# Altium schematic sheet [3] Sensor.SchDoc
size A4; Organization: UNMEI ELECTRICAL; Address1: 16B/12 Nguyen Du Street; Address2: Da Lat City, LD Province; SheetNumber: 3; SheetTotal: 7
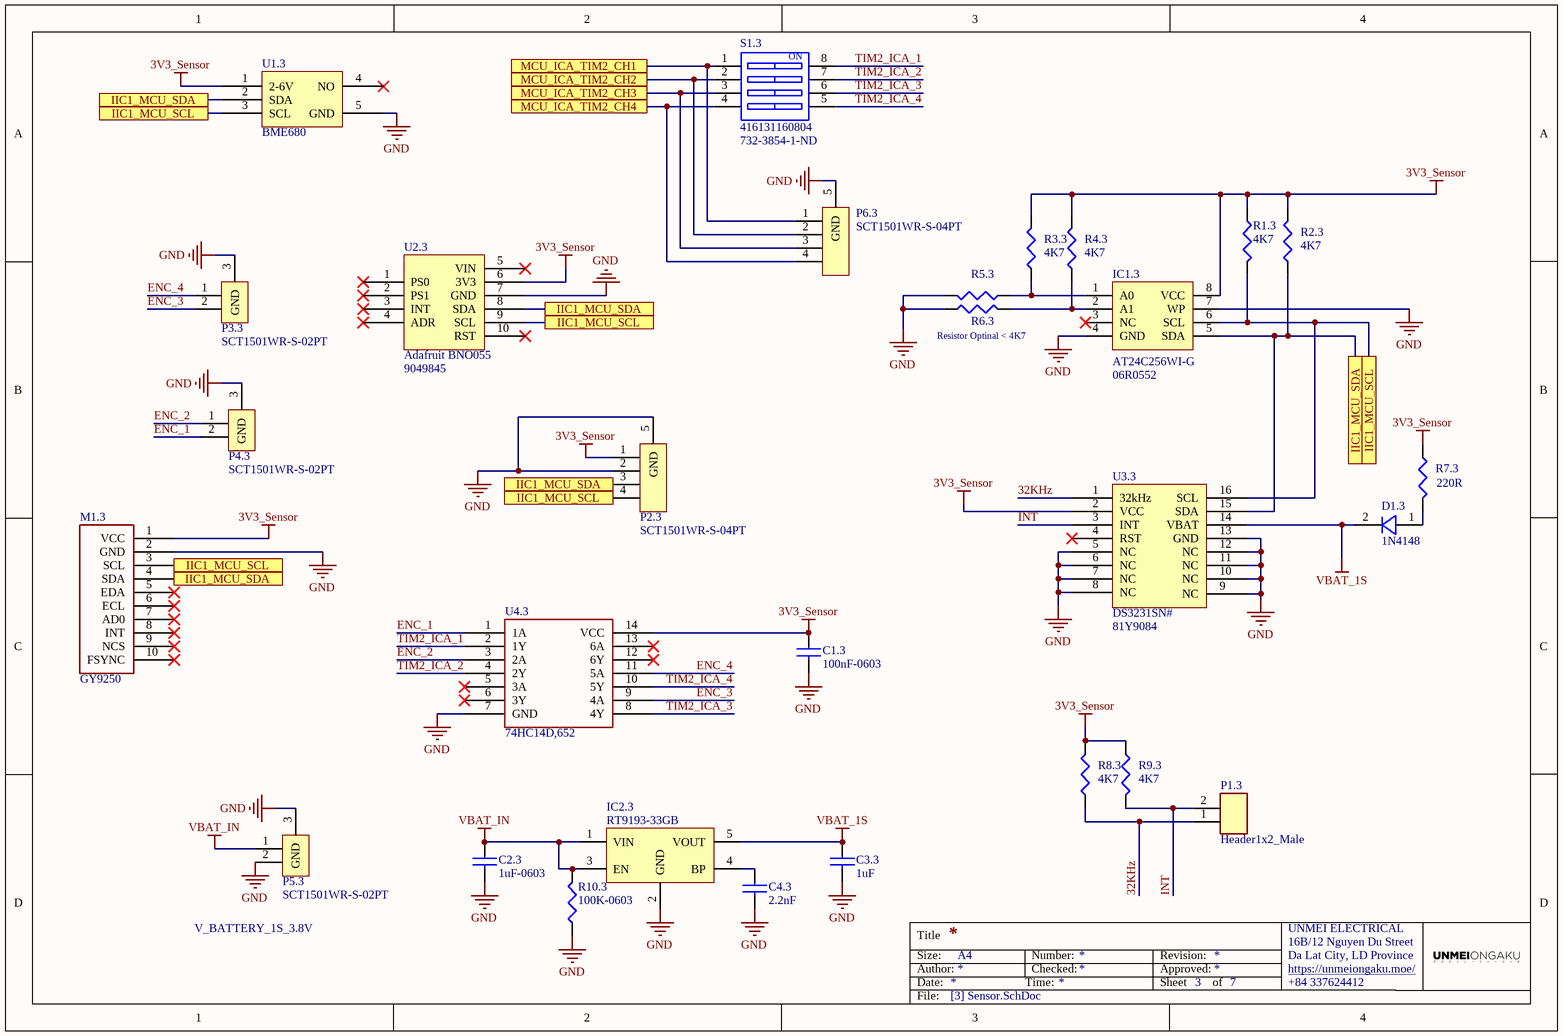
[diagram p0: [3] Sensor.SchDoc]

## Parts
C1.3  100nF-0603  [CAP0603]
C2.3  1uF-0603  [CAP0603]
C3.3  1uF  [CAP0603]
C4.3  2.2nF  [CAP0603]
D1.3  1N4148  [SOD-80]
IC1.3  AT24C256WI-G  Supplier Part Number 1: 06R0552  [SOP8]
IC2.3  RT9193-33GB  [SOT23-5]
M1.3  GY9250  [GY9250]
P1.3  Header1x2_Male  [HDR1x2_2.54_MALE]
P2.3  SCT1501WR-S-04PT  [Connector ZH1.5 4P SMD]
P3.3  SCT1501WR-S-02PT  [Connector ZH1.5 2P SMD]
P4.3  SCT1501WR-S-02PT  [Connector ZH1.5 2P SMD]
P5.3  SCT1501WR-S-02PT  [Connector ZH1.5 2P SMD]
P6.3  SCT1501WR-S-04PT  [Connector ZH1.5 4P SMD]
R1.3  4K7  [RES0603 - 3D]
R2.3  4K7  [RES0603 - 3D]
R3.3  4K7  [RES0603 - 3D]
R4.3  4K7  [RES0603 - 3D]
R5.3  70R  [RES0805]  (value not drawn)
R6.3  70R  [RES0805]  (value not drawn)
R7.3  220R  [RES0603 - 3D]
R8.3  4K7  [RES0603 - 3D]
R9.3  4K7  [RES0603 - 3D]
R10.3  100K-0603  [RES0603 - 3D]
S1.3  416131160804  Supplier Part Number 1: 732-3854-1-ND  [DIP Switches SMD 1.27mm 4P]
U1.3  BME680  [BME680]
U2.3  Adafruit BNO055  Supplier Part Number 1: 9049845  [Adafruit BNO055]
U3.3  DS3231SN#  Supplier Part Number 1: 81Y9084  [SOIC-16W]
U4.3  74HC14D,652  [SOT108-1_NEX]

## Ports
IIC1_MCU_SCL, IIC1_MCU_SDA, MCU_ICA_TIM2_CH1, MCU_ICA_TIM2_CH2, MCU_ICA_TIM2_CH3, MCU_ICA_TIM2_CH4

## Nets
3V3_Sensor: C1.3.1 IC1.3.8(VCC) M1.3.1(VCC) P2.3.1 R1.3.1 R2.3.2 R3.3.2 R4.3.2 R7.3.1 R8.3.2 R9.3.1 U1.3.1(2-6V) U2.3.6(3V3) U3.3.2(VCC) U4.3.14(VCC)
GND: C1.3.2 C2.3.2 C3.3.2 C4.3.2 IC1.3.4(GND) IC1.3.7(WP) IC2.3.2(GND) M1.3.2(GND) P2.3.2 P2.3.5(GND) P3.3.3(GND) P4.3.3(GND) P5.3.2 P5.3.3(GND) P6.3.5(GND) R5.3.2 R6.3.1 R10.3.1 U1.3.5(GND) U2.3.7(GND) U3.3.5(NC) U3.3.6(NC) U3.3.7(NC) U3.3.8(NC) U3.3.9(NC) U3.3.10(NC) U3.3.11(NC) U3.3.12(NC) U3.3.13(GND) U4.3.7(GND)
VBAT_1S: C3.3.1 D1.3.2(Cathode) IC2.3.5(VOUT) U3.3.14(VBAT)
VBAT_IN: C2.3.1 IC2.3.1(VIN) IC2.3.3(EN) P5.3.1 R10.3.2
32KHz: P1.3.1 R8.3.1 U3.3.1(32kHz)
ENC_1: P4.3.2 U4.3.1(1A)
ENC_2: P4.3.1 U4.3.3(2A)
ENC_3: P3.3.2 U4.3.9(4A)
ENC_4: P3.3.1 U4.3.11(5A)
IIC1_MCU_SCL: IC1.3.6(SCL) M1.3.3(SCL) P2.3.4 R1.3.2 U1.3.3(SCL) U2.3.9(SCL) U3.3.16(SCL) ; port IIC1_MCU_SCL
IIC1_MCU_SDA: IC1.3.5(SDA) M1.3.4(SDA) P2.3.3 R2.3.1 U1.3.2(SDA) U2.3.8(SDA) U3.3.15(SDA) ; port IIC1_MCU_SDA
INT: P1.3.2 R9.3.2 U3.3.3(INT)
MCU_ICA_TIM2_CH1: P6.3.1 S1.3.1 ; port MCU_ICA_TIM2_CH1
MCU_ICA_TIM2_CH2: P6.3.2 S1.3.2 ; port MCU_ICA_TIM2_CH2
MCU_ICA_TIM2_CH3: P6.3.3 S1.3.3 ; port MCU_ICA_TIM2_CH3
MCU_ICA_TIM2_CH4: P6.3.4 S1.3.4 ; port MCU_ICA_TIM2_CH4
TIM2_ICA_1: S1.3.8 U4.3.2(1Y)
TIM2_ICA_2: S1.3.7 U4.3.4(2Y)
TIM2_ICA_3: S1.3.6 U4.3.8(4Y)
TIM2_ICA_4: S1.3.5 U4.3.10(5Y)
NetC4.3_1: C4.3.1 IC2.3.4(BP)
NetD1.3_1: D1.3.1(Anode) R7.3.2
NetIC1.3_1: IC1.3.1(A0) R3.3.1 R5.3.1
NetIC1.3_2: IC1.3.2(A1) R4.3.1 R6.3.2

Not connected (* = marked no-connect by the designer): IC1.3 3(NC)*; M1.3 5(EDA)* 6(ECL)* 7(AD0)* 8(INT)* 9(NCS)* 10(FSYNC)*; U1.3 4(NO)*; U2.3 1(PS0)* 2(PS1)* 3(INT)* 4(ADR)* 5(VIN)* 10(RST)*; U3.3 4(RST)*; U4.3 5(3A)* 6(3Y)* 12(6Y)* 13(6A)*

## Notes on the sheet
- Resistor Optinal < 4K7
- V_BATTERY_1S_3.8V
- Title
- Size:
- Date:
- Author:
- A4
- Time:
- Number:
- Checked:
- Revision:
- Sheet
- Approved:
- of
- https://unmeiongaku.moe/
- +84 337624412
- File:
- (in symbol 416131160804) ON

## Library data of the parts
C1.3 = CC0603KRX7R9BB104: CAP CER 0.1UF 50V X7R 0603; Manufacturer 1: Yageo; Category 1: Capacitors; Capacitance: 0.1µF; Tolerance: ±10%; Value: 100nF; Supplier 1: Digi-Key; Supplier Part Number 1: 311-1344-1-ND; Manufacturer Part Number 1: CC0603KRX7R9BB104; RoHS 1: RoHS Compliant; Description 1: CAP CER 0.1UF 50V X7R 0603; Stock 1: 4411645; Pricing 1: 1=0.1, 10=0.031, 100=0.014, 500=0.00998, 1000=0.00783 (USD); Packaging: Cut Tape (CT); Part Status: Active; Voltage - Rated: 50V; Temperature Coefficient: X7R; Operating Temperature: -55°C ~ 125°C; Features: -; Ratings: -; Applications: General Purpose; Failure Rate: -; Mounting Type: Surface Mount, MLCC; Package / Case: 0603 (1608 Metric); Size / Dimension: 0.063" L x 0.031" W (1.60mm x 0.80mm); Height - Seated (Max): -; Thickness (Max): 0.035" (0.90mm); Lead Spacing: -; Lead Style: -; ComponentLink1URL: http://www.yageo.com/documents/recent/UPY-GPHC_X7R_6.3V-to-50V_18.pdf; ComponentLink1Description: http://www.yageo.com/documents/recent/UPY-GPHC_X7R_6.3V-to-50V_18.pdf
C2.3 C3.3 = CC0603KRX7R7BB105: CAP CER 1UF 16V X7R 0603; Manufacturer 1: Yageo; Category 1: Capacitors; Capacitance: 1µF; Tolerance: ±10%; Supplier 1: Digi-Key; Supplier Part Number 1: 311-1446-1-ND; Manufacturer Part Number 1: CC0603KRX7R7BB105; RoHS 1: RoHS Compliant; Description 1: CAP CER 1UF 16V X7R 0603; Stock 1: 274580; Pricing 1: 1=0.1, 10=0.051, 100=0.0227, 500=0.0162, 1000=0.01274 (USD); Packaging: Cut Tape (CT); Part Status: Active; Voltage - Rated: 16V; Temperature Coefficient: X7R; Operating Temperature: -55°C ~ 125°C; Features: -; Ratings: -; Applications: General Purpose; Failure Rate: -; Mounting Type: Surface Mount, MLCC; Package / Case: 0603 (1608 Metric); Size / Dimension: 0.063" L x 0.031" W (1.60mm x 0.80mm); Height - Seated (Max): -; Thickness (Max): 0.035" (0.90mm); Lead Spacing: -; Lead Style: -; ComponentLink1URL: http://www.yageo.com/documents/recent/UPY-GPHC_X7R_6.3V-to-50V_18.pdf; ComponentLink1Description: http://www.yageo.com/documents/recent/UPY-GPHC_X7R_6.3V-to-50V_18.pdf; Value: 1uF
C4.3 = CC0603KRX7R9BB222: Multilayer Ceramic Capacitors MLCC - SMD/SMT 2200PF 50V 10% 0603; Manufacturer: Yageo; Type: General Purpose and High Capacitance Surface Mount Ceramic Multilayer Capacitor; Voltage Rating DC: 50 VDC; Capacitance - uF: 0.0022 uF; Class: Class 2; Dielectric: X7R; Supplier 1: Mouser; Manufacturer Part Number: CC0603KRX7R9BB222; RoHS: RoHS Compliant; Category: Multilayer Ceramic Capacitors MLCC - SMD/SMT; Stock 1: 167669; Pricing 1: 1=0.100, 10=0.090, 100=0.070, 1000=0.065, 4000=0.010, 8000=0.009 (USD); Capacitance: 2200 pF; Height: 0.8 mm; Length: 1.6 mm; Package / Case: 0603 (1608 metric); Packaging: Cut Tape; Product: General Type MLCCs; Series: CC; Termination Style: SMD/SMT; Tolerance: 10 %; Brand: Yageo; Capacitance - nF: 2.2 nF; Case Code - in: 0603; Case Code - mm: 1608; Maximum Operating Temperature: + 125 C; Minimum Operating Temperature: - 55 C; Product Type: Ceramic Capacitors; Standard Pack Qty: 4000; Subcategory: Capacitors; Termination: Standard; RoHS - Mouser: Y; Minimum Order Quantity: 1; Reeling: True; ComponentLink1URL: https://www.mouser.com/datasheet/2/447/UPY-GPHC_X7R_6.3V-to-50V_18-1154002.pdf; ComponentLink1Description: https://www.mouser.com/datasheet/2/447/UPY-GPHC_X7R_6.3V-to-50V_18-1154002.pdf; Supplier Part Number 1: 603-C0603KRX7R9BB222; Width: 0.8 mm; Value: 2.2nF
D1.3 = 1N4148: Rectifier Diode Small Signal Switching 100V 0.2A 4ns Automotive 2-Pin DO-35 Ammo; Manufacturer: NTE Electronics; Forward Voltage: 1V; Element Configuration: Single; Max Repetitive Reverse Voltage (Vrrm): 75V; Forward Current: 300mA; Current Rating: 200mA; Polarity: Standard; Capacitance: 4pF; Max Forward Surge Current (Ifsm): 1A; Power Dissipation: 500mW; Supplier 1: Allied Electronics; Manufacturer Part Number: 1N4148; RoHS: Yes; Category: Rectifier Diodes; Stock 1: 5690; Pricing 1: 1=0.08800 (USD); Mount: Through Hole; Case/Package: DO-35; Number of Pins: 2; Min Operating Temperature: -65°C; Max Operating Temperature: 175°C; Packaging: Tape and Reel; Reverse Recovery Time: 4ns; Voltage Rating (DC): 100V; Output Current: 200mA; Diameter: 2mm; Length: 4mm; RoHS Compliant: Yes; Lead Free: Lead Free; ComponentLink1URL: https://datasheet.ciiva.com/7624/1n4148-4448-7624426.pdf?src-supplier=Element14; ComponentLink1Description: https://datasheet.ciiva.com/7624/1n4148-4448-7624426.pdf?src-supplier=Element14; Supplier Part Number 1: 70214727
IC1.3 = AT24C256WI-G: CAT24C256 Series 256 Kb (32K X 8)  1.8 V - 5.5 V I2C CMOS Serial EEPROM - SOIC-8; Manufacturer: ON Semiconductor; Manufacturer Part Number: CAT24C256WI-G; Frequency: 400kHz; Access Time: 500ns; Memory Size: 256Kb; Interface: I2C,Serial; Max Supply Voltage: 5.5V; Min Supply Voltage: 1.8V; Memory Type: Non-Volatile,EEPROM; Max Frequency: 100kHz; Nominal Supply Current: 3mA; Access Time-Max: 900ns; Organization: 32KX8; Write Protection: YES; Operating Supply Voltage: 5V; Write Cycle Time-Max (tWC): 5ms; Supplier 1: Newark; RoHS: Yes; Category: EEPROM; Mount: Surface Mount; Case/Package: SOIC; Number of Pins: 8; Contact Plating: Gold; Min Operating Temperature: -40°C; Max Operating Temperature: 85°C; Packaging: Rail/Tube; Package Quantity: 100; Series: -; Density: 256Kb; Supply Current: 3mA; Supply Voltage-Nom: 5.5V; Radiation Hardening: No; Lead Free: Lead Free; RoHS Compliant: Yes; Reach SVHC Compliant: Yes; ComponentLink1URL: https://datasheet.ciiva.com/1166/cat24c256-d-1166416.pdf?src-supplier=Newark; ComponentLink1Description: https://datasheet.ciiva.com/1166/cat24c256-d-1166416.pdf?src-supplier=Newark; ComponentLink2URL: https://datasheet.ciiva.com/15123/getdatasheetpartid-257691-15123320.pdf?src-supplier=Verical; ComponentLink2Description: https://datasheet.ciiva.com/15123/getdatasheetpartid-257691-15123320.pdf?src-supplier=Verical; ComponentLink3URL: https://datasheet.ciiva.com/5700/cat24c256-d-5700793.pdf?src-supplier=Farnell; ComponentLink3Description: https://datasheet.ciiva.com/5700/cat24c256-d-5700793.pdf?src-supplier=Farnell; ComponentLink4URL: https://datasheet.ciiva.com/8072/cat24c256-d-8072141.pdf?src-supplier=Element14; ComponentLink4Description: https://datasheet.ciiva.com/8072/cat24c256-d-8072141.pdf?src-supplier=Element14; ComponentLink5URL: https://datasheet.ciiva.com/4859/cat24c256-d-105771-4859399.pdf?src-supplier=Mouser; ComponentLink5Description: https://datasheet.ciiva.com/4859/cat24c256-d-105771-4859399.pdf?src-supplier=Mouser; ComponentLink6URL: https://datasheet.ciiva.com/3185/cat24c256-d-3185116.pdf?src-supplier=Avnet; ComponentLink6Description: https://datasheet.ciiva.com/3185/cat24c256-d-3185116.pdf?src-supplier=Avnet; ComponentLink7URL: https://datasheet.ciiva.com/16456/cat24c256-d-16456381.pdf?src-supplier=Future+Electronics; ComponentLink7Description: https://datasheet.ciiva.com/16456/cat24c256-d-16456381.pdf?src-supplier=Future+Electronics; ComponentLink8URL: https://datasheet.ciiva.com/1912/cat24c256-d-1912247.pdf?src-supplier=Digi-Key; ComponentLink8Description: https://datasheet.ciiva.com/1912/cat24c256-d-1912247.pdf?src-supplier=Digi-Key
IC2.3 = RT9193-33GB: IC REG LDO 3.3V 0.3A SOT23-5
P1.3 = HDR1x2_2.54_MALE: Header1x2_2.54_MALE
R1.3 R2.3 R3.3 R4.3 R8.3 R9.3 = RC0603JR-074K7L: RES SMD 4.7K OHM 5% 1/10W 0603; Manufacturer: Yageo; Power (Watts): 0.1W, 1/10W; Temperature Coefficient: ±100ppm/°C; Supplier 1: Digi-Key; Manufacturer Part Number: RC0603JR-074K7L; RoHS: RoHS Compliant; Category: Resistors; Stock 1: 4925196; Pricing 1: 1=0.1, 10=0.011, 100=0.0046, 1000=0.00207, 2500=0.0018 (USD); Packaging: Cut Tape (CT); Part Status: Active; Tolerance: ±5%; Composition: Thick Film; Features: Moisture Resistant; Operating Temperature: -55°C ~ 155°C; Package / Case: 0603 (1608 Metric); Supplier Device Package: 0603; Size / Dimension: 0.063" L x 0.032" W (1.60mm x 0.80mm); Height - Seated (Max): 0.022" (0.55mm); Failure Rate: -; ComponentLink1URL: http://www.yageo.com/documents/recent/PYu-RC_Group_51_RoHS_L_7.pdf; ComponentLink1Description: http://www.yageo.com/documents/recent/PYu-RC_Group_51_RoHS_L_7.pdf; Supplier Part Number 1: 311-4.7KGRCT-ND; Value: 4K7
R5.3 R6.3 = RC0805JR-070RP: Res Jumper Thick Film 0805 0 Ohm 5% 1/8W Molded SMD Paper T/R; Manufacturer: Yageo; Resistance: 0mR; Max Power Dissipation: 125mW; Supplier 1: Arrow Electronics; Manufacturer Part Number: RC0805JR-070RP; RoHS: Yes; Category: Chip SMD Resistors; Stock 1: 10000; Pricing 1: 5000=0.00800, 10000=0.00690, 25000=0.00590, 50000=0.00480 (USD); Case/Package: 0805; Case Code (Metric): 2012; Case Code (Imperial): 0805; Min Operating Temperature: -55°C; Max Operating Temperature: 155°C; Resistor Type: Thick Film; Packaging: Tape and Reel; Number of Terminations: 2; Features: Moisture Resistant; Length: 0.079inch; Width: 0.049inch; Height: 0.024inch; Supplier Part Number 1: RC0805JR-070RP
R7.3 = RC0603JR-07220RL: RES SMD 220 OHM 5% 1/10W 0603; Manufacturer 1: Yageo; Category 1: Resistors; Resistance (Ohms): 220; Power (Watts): 0.1W, 1/10W; Temperature Coefficient: ±100ppm/°C; Supplier 1: Digi-Key; Supplier Part Number 1: 311-220GRCT-ND; Manufacturer Part Number 1: RC0603JR-07220RL; RoHS 1: RoHS Compliant; Description 1: RES SMD 220 OHM 5% 1/10W 0603; Stock 1: 1346821; Pricing 1: 1=0.1, 10=0.011, 100=0.0044, 1000=0.00198, 2500=0.00172 (USD); Packaging: Cut Tape (CT); Part Status: Active; Tolerance: ±5%; Composition: Thick Film; Features: Moisture Resistant; Operating Temperature: -55°C ~ 155°C; Package / Case: 0603 (1608 Metric); Supplier Device Package: 0603; Size / Dimension: 0.063" L x 0.031" W (1.60mm x 0.80mm); Height - Seated (Max): 0.022" (0.55mm); Failure Rate: -; ComponentLink1URL: http://www.yageo.com/documents/recent/PYu-RC_Group_51_RoHS_L_7.pdf; ComponentLink1Description: http://www.yageo.com/documents/recent/PYu-RC_Group_51_RoHS_L_7.pdf; Value: 220R
R10.3 = RC0603JR-07100KL: RES SMD 100K OHM 5% 1/10W 0603; Manufacturer 1: Yageo; Category 1: Resistors; Power (Watts): 0.1W, 1/10W; Temperature Coefficient: ±100ppm/°C; Supplier 1: Digi-Key; Supplier Part Number 1: 311-100KGRCT-ND; Manufacturer Part Number 1: RC0603JR-07100KL; RoHS 1: RoHS Compliant; Description 1: RES SMD 100K OHM 5% 1/10W 0603; Stock 1: 3591837; Pricing 1: 1=0.1, 10=0.011, 100=0.0044, 1000=0.00198, 2500=0.00172 (USD); Packaging: Cut Tape (CT); Part Status: Active; Resistance (Ohms): 100k; Tolerance: ±5%; Composition: Thick Film; Features: Moisture Resistant; Operating Temperature: -55°C ~ 155°C; Package / Case: 0603 (1608 Metric); Supplier Device Package: 0603; Size / Dimension: 0.063" L x 0.031" W (1.60mm x 0.80mm); Height - Seated (Max): 0.022" (0.55mm); Failure Rate: -; ComponentLink1URL: http://www.yageo.com/documents/recent/PYu-RC_Group_51_RoHS_L_7.pdf; ComponentLink1Description: http://www.yageo.com/documents/recent/PYu-RC_Group_51_RoHS_L_7.pdf; Value: 100K
S1.3 = 416131160804: DIP Switch Dimensions L x W x H: 5.6 x 2 mm Series: WS-DISV L: 6.12 mm Poles: 4; Manufacturer: Wurth Electronics; Body Material: Polyphenylene,Polyphthalamide; Mechanical Life: 2000Cycles; Contact Resistance: 50mR; Contact Current Rating: 25mA; Number of Positions: 4; Voltage Rating (DC): 24V; Electrical Life: 1000Cycles; Throw Configuration: SPST; Insulation Resistance: 100MR; Actuator Type: Slide (Standard); Pitch: 0.05inch; Washable: Yes; Supplier 1: Digi-Key; Manufacturer Part Number: 416131160804; RoHS: Yes; Category: DIP Switches; Stock 1: 13030; Pricing 1: 1=5.25000, 10=5.08200, 50=4.81400, 100=4.27900, 500=4.01200 (USD); Mount: Surface Mount; Contact Material: Copper Alloy,Gold; Contact Plating: Gold; Min Operating Temperature: -40°C; Max Operating Temperature: 85°C; Package Quantity: 1; Packaging: Cut Tape; Current Rating: 25mA; Termination: Gull Wing; Number of Circuits: 4; Max Voltage Rating (DC): 24V; Series: WS-DISV; Length: 0.241inch; Width: 5.6mm; Height: 2mm; Reach SVHC Compliant: Yes; Lead Free: Lead Free; RoHS Compliant: Yes; ComponentLink1URL: https://datasheet.ciiva.com/30467/0900766b812902d9-30467107.pdf?src-supplier=RSComponents; ComponentLink1Description: https://datasheet.ciiva.com/30467/0900766b812902d9-30467107.pdf?src-supplier=RSComponents; ComponentLink2URL: https://datasheet.ciiva.com/1528/4161311608xx-1528928.pdf?src-supplier=Element14; ComponentLink2Description: https://datasheet.ciiva.com/1528/4161311608xx-1528928.pdf?src-supplier=Element14; ComponentLink3URL: https://datasheet.ciiva.com/2863/4161311608xx-2863702.pdf?src-supplier=Digi-Key; ComponentLink3Description: https://datasheet.ciiva.com/2863/4161311608xx-2863702.pdf?src-supplier=Digi-Key; ComponentLink4URL: https://datasheet.ciiva.com/2863/4161311608xx-2863701.pdf?src-supplier=Digi-Key; ComponentLink4Description: https://datasheet.ciiva.com/2863/4161311608xx-2863701.pdf?src-supplier=Digi-Key; ComponentLink5URL: https://datasheet.ciiva.com/1625/4161311608xx-1625344.pdf?src-supplier=Farnell; ComponentLink5Description: https://datasheet.ciiva.com/1625/4161311608xx-1625344.pdf?src-supplier=Farnell
U1.3 = BME680: Pimoroni.com - Pressure, Temperature and Humidity Sensor Digital Output 1.8V 8-Pin LGA; Manufacturer: Bosch Sensortec; Output Type: SPI,I2C; Supplier 1: Future Electronics; Manufacturer Part Number: BME680; RoHS: No; Category: Uncategorized; Stock 1: 64; Pricing 1: 1=9.84000, 20=8.81000, 125=8.18000, 500=7.71000, 3000=7.09000 (USD); Min Operating Temperature: -40°C; Max Operating Temperature: 85°C; Sensor Type: Temperature; ComponentLink1URL: https://ae-bst.resource.bosch.com/media/_tech/media/application_notes/BST-BME680-HS000-05.pdf?src-supplier=Digi-Key; ComponentLink1Description: https://ae-bst.resource.bosch.com/media/_tech/media/application_notes/BST-BME680-HS000-05.pdf?src-supplier=Digi-Key; ComponentLink2URL: https://ae-bst.resource.bosch.com/media/_tech/media/product_flyer/BST-BME680-FL000.pdf?src-supplier=Digi-Key; ComponentLink2Description: https://ae-bst.resource.bosch.com/media/_tech/media/product_flyer/BST-BME680-FL000.pdf?src-supplier=Digi-Key
U2.3 = Adafruit BNO055: BNO055 Series 1.7 to 3.6 V Intelligent 9-Axis Absolute Orientation Sensor-LGA-28; Manufacturer: Bosch; Sensor Type: Accelerometer,Gyroscope,Magnetometer,3 Axis; Output Type: I2C; Supplier 1: Future Electronics; Manufacturer Part Number: BNO055; RoHS: No; Category: Inertial Measurement Units (IMUs); Pricing 1: 4000=7.70000 (USD); Mount: Surface Mount; Case/Package: LGA; Min Operating Temperature: -40°C; Max Operating Temperature: 85°C; Packaging: Tape and Reel; Lead Free: Lead Free; ComponentLink1URL: https://ae-bst.resource.bosch.com/media/_tech/media/application_notes/BST-BNO055-HS000.pdf ?src-supplier=Digi-Key; ComponentLink1Description: https://ae-bst.resource.bosch.com/media/_tech/media/application_notes/BST-BNO055-HS000.pdf ?src-supplier=Digi-Key
U3.3 = DS3231SN#: DS3231 Series 5.5 V Extremely Accurate I2C-Integrated RTC/TCXO/Crystal - SOIC-16; Manufacturer: Maxim; Logic Function: Clock; Time Format: HH:MM:SS; Max Supply Voltage: 5.5V; Min Supply Voltage: 2.3V; Operating Supply Voltage: 3.3V; Interface: I2C,Serial,2-Wire; Date Format: YY-MM-DD-dd; Number of Outputs: 1; Frequency: 32.768kHz; Supplier 1: Newark; Manufacturer Part Number: DS3231SN#; RoHS: Yes; Category: Real Time Clocks; Pricing 1: 1=11.12000, 10=10.69000, 25=10.25000, 138=9.03000, 276=8.59000, 506=8.31000 (USD); Mount: Surface Mount; Case/Package: SOIC; Number of Pins: 16; Weight: 0.023492oz; Min Operating Temperature: -40°C; Max Operating Temperature: 85°C; Package Quantity: 46; Packaging: Bulk; Series: DS3231SN; Termination: SMD/SMT; Length: 10.5mm; Width: 7.6mm; Height: 2.35mm; Radiation Hardening: No; RoHS Compliant: Yes; Lead Free: Lead Free; ComponentLink1URL: https://datasheet.ciiva.com/1139/1675711-1139210.pdf?src-supplier=Element14; ComponentLink1Description: https://datasheet.ciiva.com/1139/1675711-1139210.pdf?src-supplier=Element14; ComponentLink2URL: https://datasheet.ciiva.com/23867/45724-23867216.pdf?src-supplier=Newark; ComponentLink2Description: https://datasheet.ciiva.com/23867/45724-23867216.pdf?src-supplier=Newark; ComponentLink3URL: https://datasheet.ciiva.com/1146/ds3231-1146707.pdf?src-supplier=Newark; ComponentLink3Description: https://datasheet.ciiva.com/1146/ds3231-1146707.pdf?src-supplier=Newark; ComponentLink4URL: https://datasheet.ciiva.com/1240/ds3231-ds3231s-1240689.pdf?src-supplier=Digi-Key; ComponentLink4Description: https://datasheet.ciiva.com/1240/ds3231-ds3231s-1240689.pdf?src-supplier=Digi-Key; ComponentLink5URL: https://datasheet.ciiva.com/4772/ds3231-102175-4772091.pdf?src-supplier=Mouser; ComponentLink5Description: https://datasheet.ciiva.com/4772/ds3231-102175-4772091.pdf?src-supplier=Mouser; ComponentLink6URL: https://datasheet.ciiva.com/12291/ds3231-102175-12291423.pdf?src-supplier=Mouser; ComponentLink6Description: https://datasheet.ciiva.com/12291/ds3231-102175-12291423.pdf?src-supplier=Mouser; ComponentLink7URL: https://datasheet.ciiva.com/14244/ds3231-14244059.pdf?src-supplier=Avnet; ComponentLink7Description: https://datasheet.ciiva.com/14244/ds3231-14244059.pdf?src-supplier=Avnet
U4.3 = 74HC14D,652: Vendor: Nexperia; SourceLibrary: Nexperia_2018-05-2018; Manufacturer_Part_Number: 74HC14D,652; Copyright: Copyright (C) 2016 Accelerated Designs. All rights reserved; RefDes: RefDes; Type: DEV; Value: Value; Local Supplier: thegioiic; Local Supplier Part Number: *; Local Supplier Link: https://www.thegioiic.com/products/74hc14d
M1.3 = GY9250: Local Supplier: thegioiic; Local Supplier Part Number: *; Local Supplier Link: https://www.thegioiic.com/products/gy-9250-mach-cam-bien-9dof